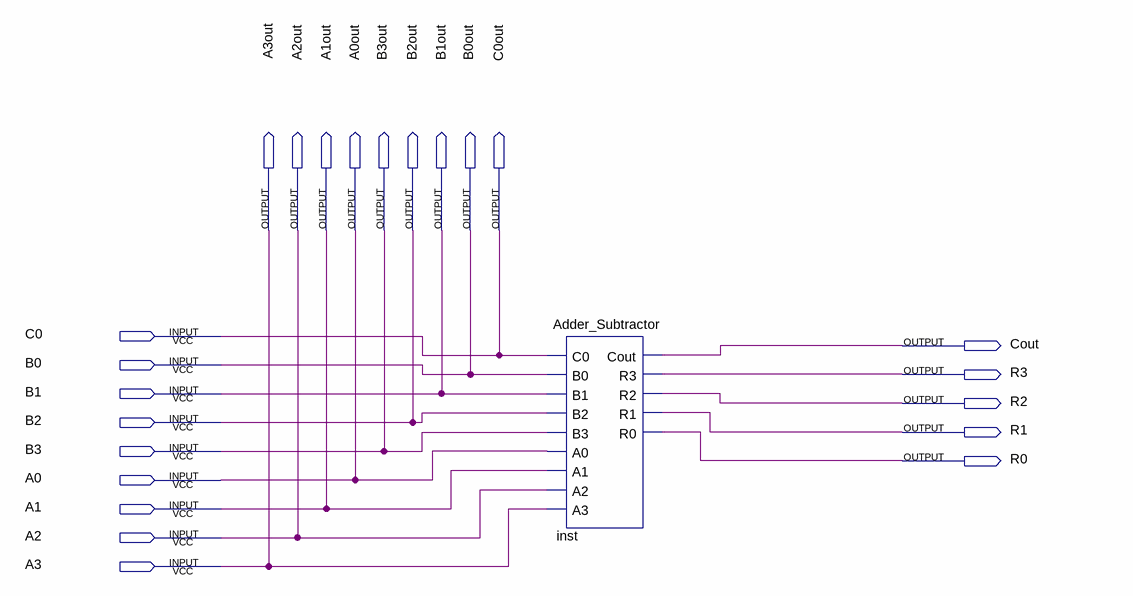
[diagram p0: schematic sheet]
// Quartus schematic Lab-5-AdderSubtractor.bdf as structural Verilog: 1 symbols, 23 pins
module \Lab-5-AdderSubtractor  (
  input  C0,
  input  B0,
  input  B1,
  input  B2,
  input  B3,
  input  A0,
  input  A1,
  input  A2,
  input  A3,
  output A3out,
  output A2out,
  output A1out,
  output A0out,
  output B3out,
  output B2out,
  output B1out,
  output B0out,
  output C0out,
  output Cout,
  output R3,
  output R2,
  output R1,
  output R0
);

  Adder_Subtractor inst (
    .C0(C0), .B0(B0), .B1(B1), .B2(B2), .B3(B3), .A0(A0), .A1(A1), .A2(A2), .A3(A3), .Cout(Cout), .R3(R3),
    .R2(R2), .R1(R1), .R0(R0));

  assign A0out = A0;
  assign A1out = A1;
  assign A2out = A2;
  assign A3out = A3;
  assign B0out = B0;
  assign B1out = B1;
  assign B2out = B2;
  assign B3out = B3;
  assign C0out = C0;
endmodule
